# Altium project keyboard-for-hmi.PrjPcb
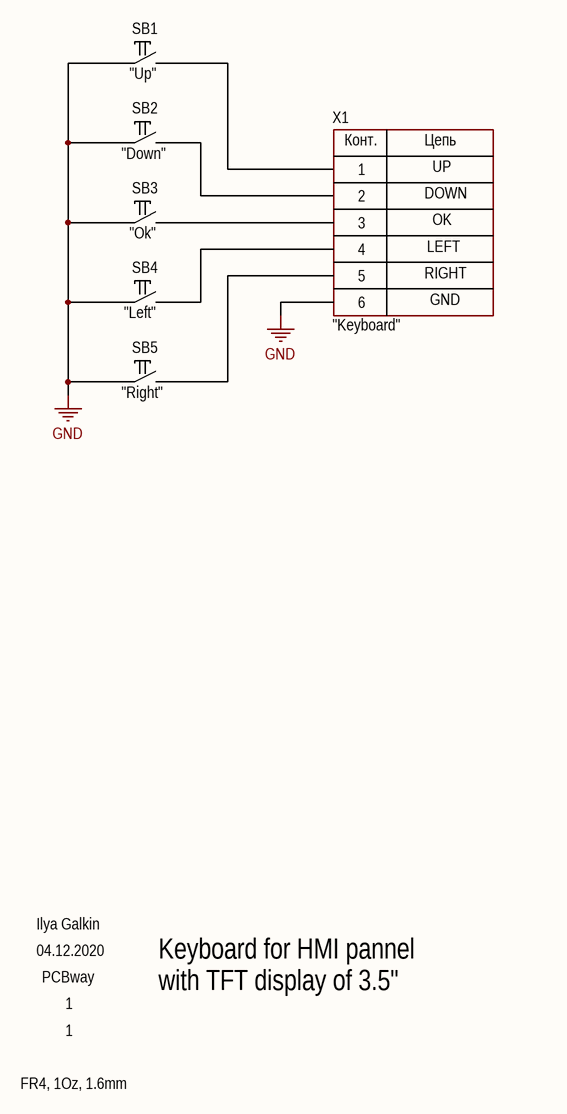
[diagram p0: keyboard.SchDoc]
1 sheet, 6 parts. Net scope: global (net labels, ports and power ports of the same name join across sheets).
Board file: pcb.PcbDoc

## Sheet keyboard.SchDoc: =GlobalProjectName
size 209 x 297 mm; ApprovedBy: Утвердил; CheckedBy: Проверил; Author: Разработал; SheetNumber: Лист; SheetTotal: Листов; PageSetup: Record=PageOptions|CenterHorizontal=True|CenterVertical=True|PrintScale=1.00|XCorrection=1.00|YCorrection=1.00|PrintKind=1|BorderSize=5000000|LeftOffset=0|BottomOffset=0|Orientation=2|PaperLength=1000|PaperWidth=1000|Scale=100|PaperSource=15|PrintQuality=1200|MediaType=1|DitherType=10|PaperKind=A3|PrintScaleMode=1; Weight: -; ScaleFactor: -; NormInspection: Норм.Контр.

### Parts
SB1  CommentText: "Up"  [BUT: 6x6]
SB2  CommentText: "Down"  [BUT: 6x6]
SB3  CommentText: "Ok"  [BUT: 6x6]
SB4  CommentText: "Left"  [BUT: 6x6]
SB5  CommentText: "Right"  [BUT: 6x6]
X1  CommentText: "Keyboard"  [CON: CWF-6R]

### Nets
GND: SB1.1 SB2.1 SB3.1 SB4.1 SB5.1 X1.6
NetSB1_2: SB1.2 X1.1
NetSB2_2: SB2.2 X1.2
NetSB3_2: SB3.2 X1.3
NetSB4_2: SB4.2 X1.4
NetSB5_2: SB5.2 X1.5

### Notes on the sheet
- DOWN
- UP
- LEFT
- OK
- RIGHT
- GND
- Ilya Galkin
- 04.12.2020
- PCBway
- 1
- Keyboard for HMI pannel
- with TFT display of 3.5"
- FR4, 1Oz, 1.6mm
- Author
- Manufacturer
- Date
- Page
- Total pages
- Size page
- A3
- Materials
- (in symbol CWF-6) Конт.; Цепь

### Library data of the parts
SB1-SB5 = Button_tactile: Manufacturer: TE Connectivity; ValueManufacturerPartNumber: Tactile button, 6x6mm; PartNumber: FSM2JSMAATR; TypeButton: Tactile button; HelpURL: https://www.digikey.com/product-detail/en/te-connectivity-alcoswitch-switches/FSM2JSMAATR/450-1792-1-ND/3503931; Package: 6x6mm
X1 = CWF-6: Manufacturer: Connfly; ValueManufacturerPartNumber: Connector, 6pin, 2.54mm, 250VAC, 3A; PartNumber: CWF-6R; TypeConnector: Connector; VoltageMax: 250VAC; Pitch: 2.54mm; CurrentMax: 3A; Multichannel: 6pin; HelpURL: https://www.chipdip.ru/product/cwf-6r-ds1069-6-mr